# EAGLE design Attiny_Neopixel_Button (EAGLE 8.4.3)
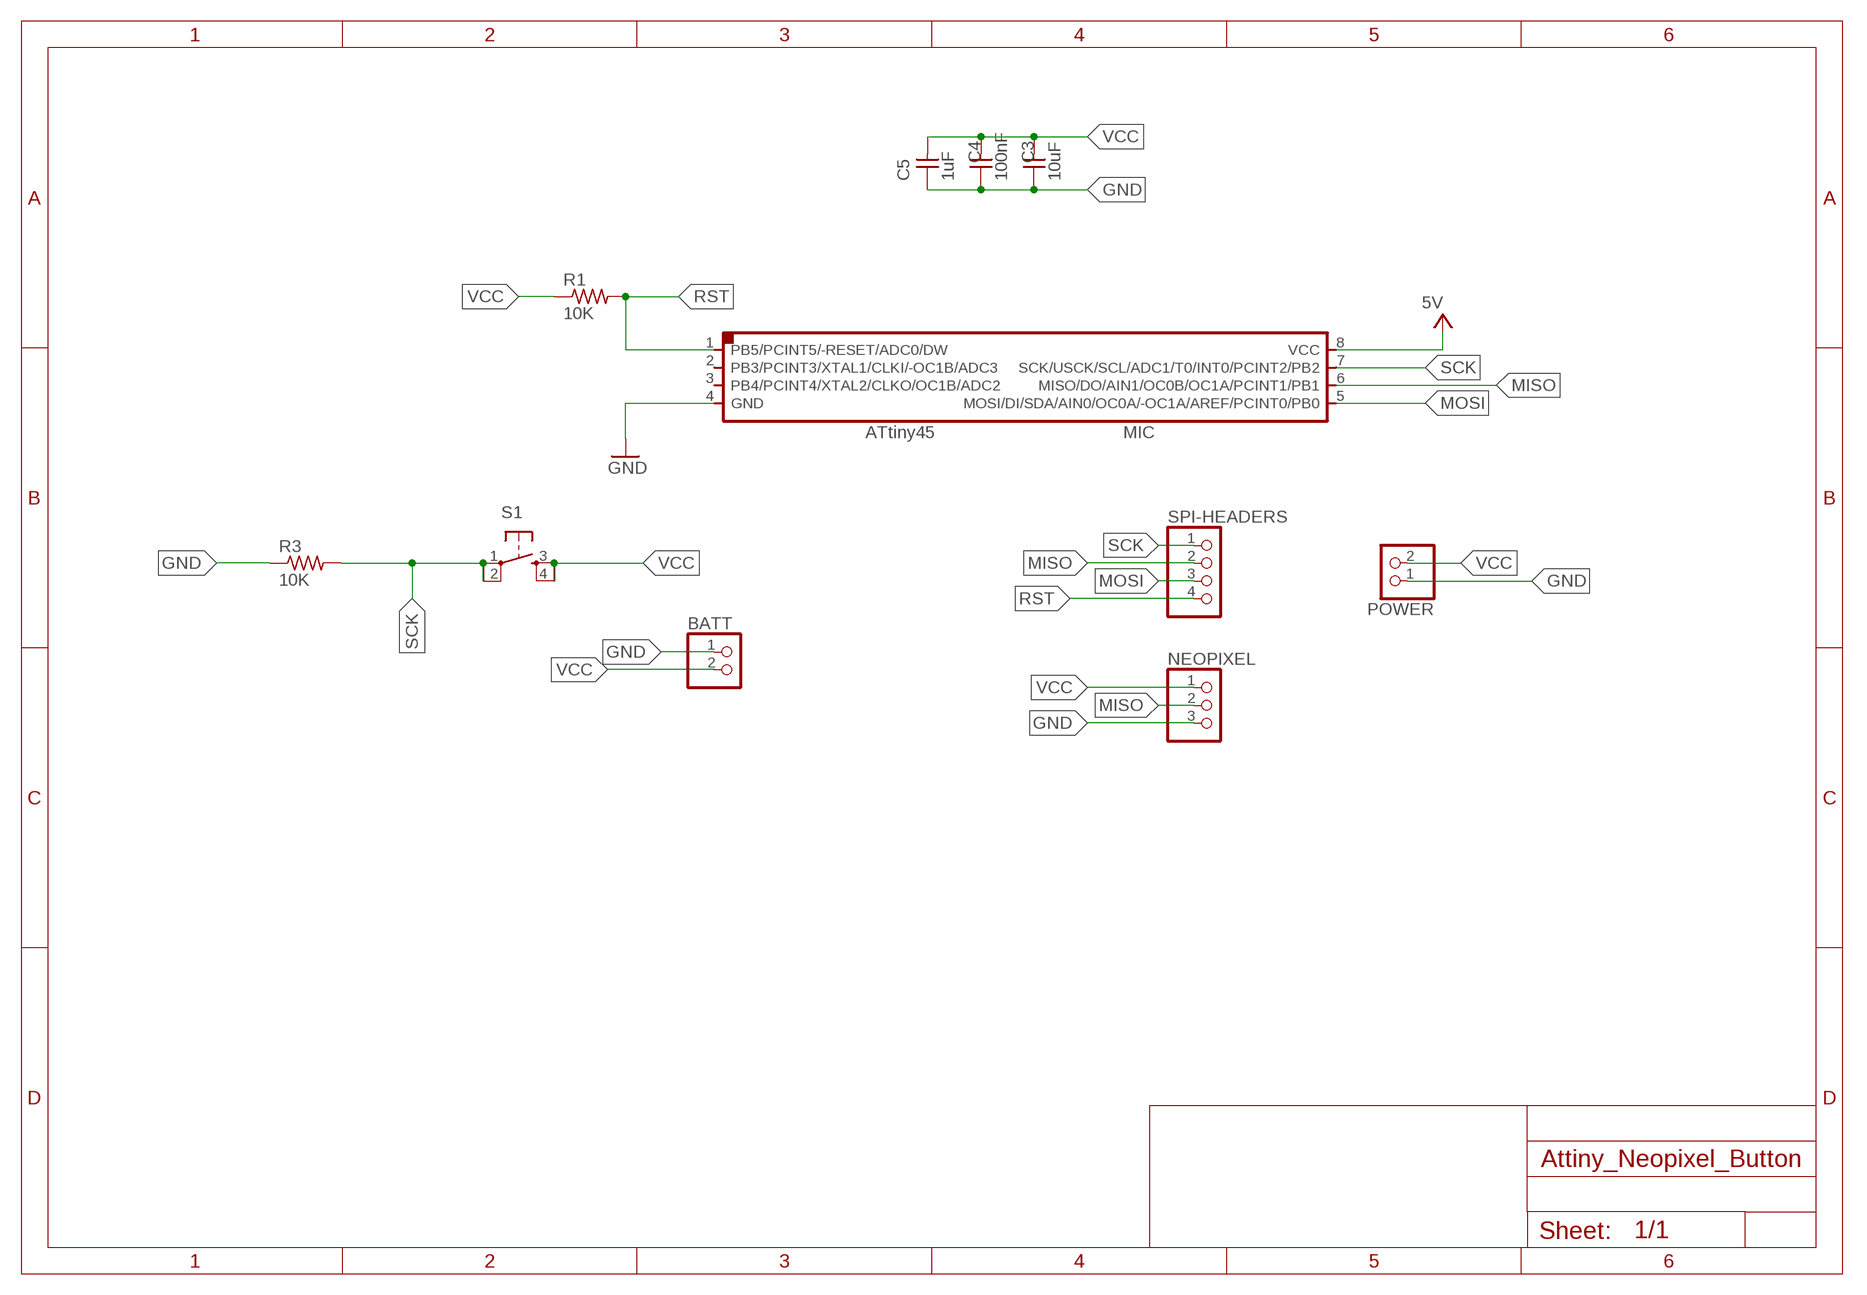
[diagram p0: schematic, sheet 1]

## Parts
BATT  PINHD-1X2  [1X02]
C3  10uF  UNPOLARIZED_CAPACITOR1206  [1206]
C4  100nF  UNPOLARIZED_CAPACITOR1206  [1206]
C5  1uF  UNPOLARIZED_CAPACITOR1206  [1206]
MIC  ATTINY45SI  [SOIC8]
NEOPIXEL  PINHD-1X3  [1X03]
POWER  PINHD-1X2  [1X02]
R1  10K  RESISTOR1206  [1206]
R3  10K  RESISTOR1206  [1206]
S1  6MM_SWITCH6MM_SWITCH  [6MM_SWITCH]
SPI-HEADERS  PINHD-1X4  [1X04]

## Nets
GND: BATT.1 C3.1 C4.1 C5.1 MIC.4(GND) NEOPIXEL.3 POWER.1 R3.1
MISO: MIC.6(MISO/DO/AIN1/OC0B/OC1A/PCINT1/PB1) NEOPIXEL.2 SPI-HEADERS.2
MOSI: MIC.5(MOSI/DI/SDA/AIN0/OC0A/-OC1A/AREF/PCINT0/PB0) SPI-HEADERS.3
RST: MIC.1(PB5/PCINT5/-RESET/ADC0/DW) R1.2 SPI-HEADERS.4
SCK: MIC.7(SCK/USCK/SCL/ADC1/T0/INT0/PCINT2/PB2) R3.2 S1.1(P) S1.2(P1) SPI-HEADERS.1
VCC: BATT.2 C3.2 C4.2 C5.2 MIC.8(VCC) NEOPIXEL.1 POWER.2 R1.1 S1.3(S) S1.4(S1) ; supply symbol labelled 5V
Unconnected: MIC.2(PB3/PCINT3/XTAL1/CLKI/-OC1B/ADC3) MIC.3(PB4/PCINT4/XTAL2/CLKO/OC1B/ADC2)

## Library data of the parts
BATT POWER = pinhead:PINHD-1X2: PIN HEADER
C3-C5 = FAB_Hello:UNPOLARIZED_CAPACITOR: unpolarized_capacitor
MIC = fab:ATTINY45
NEOPIXEL = pinhead:PINHD-1X3: PIN HEADER
R1 R3 = FAB_Hello:RESISTOR
S1 = fab:6MM_SWITCH: OMRON SWITCH
SPI-HEADERS = pinhead:PINHD-1X4: PIN HEADER

## Board
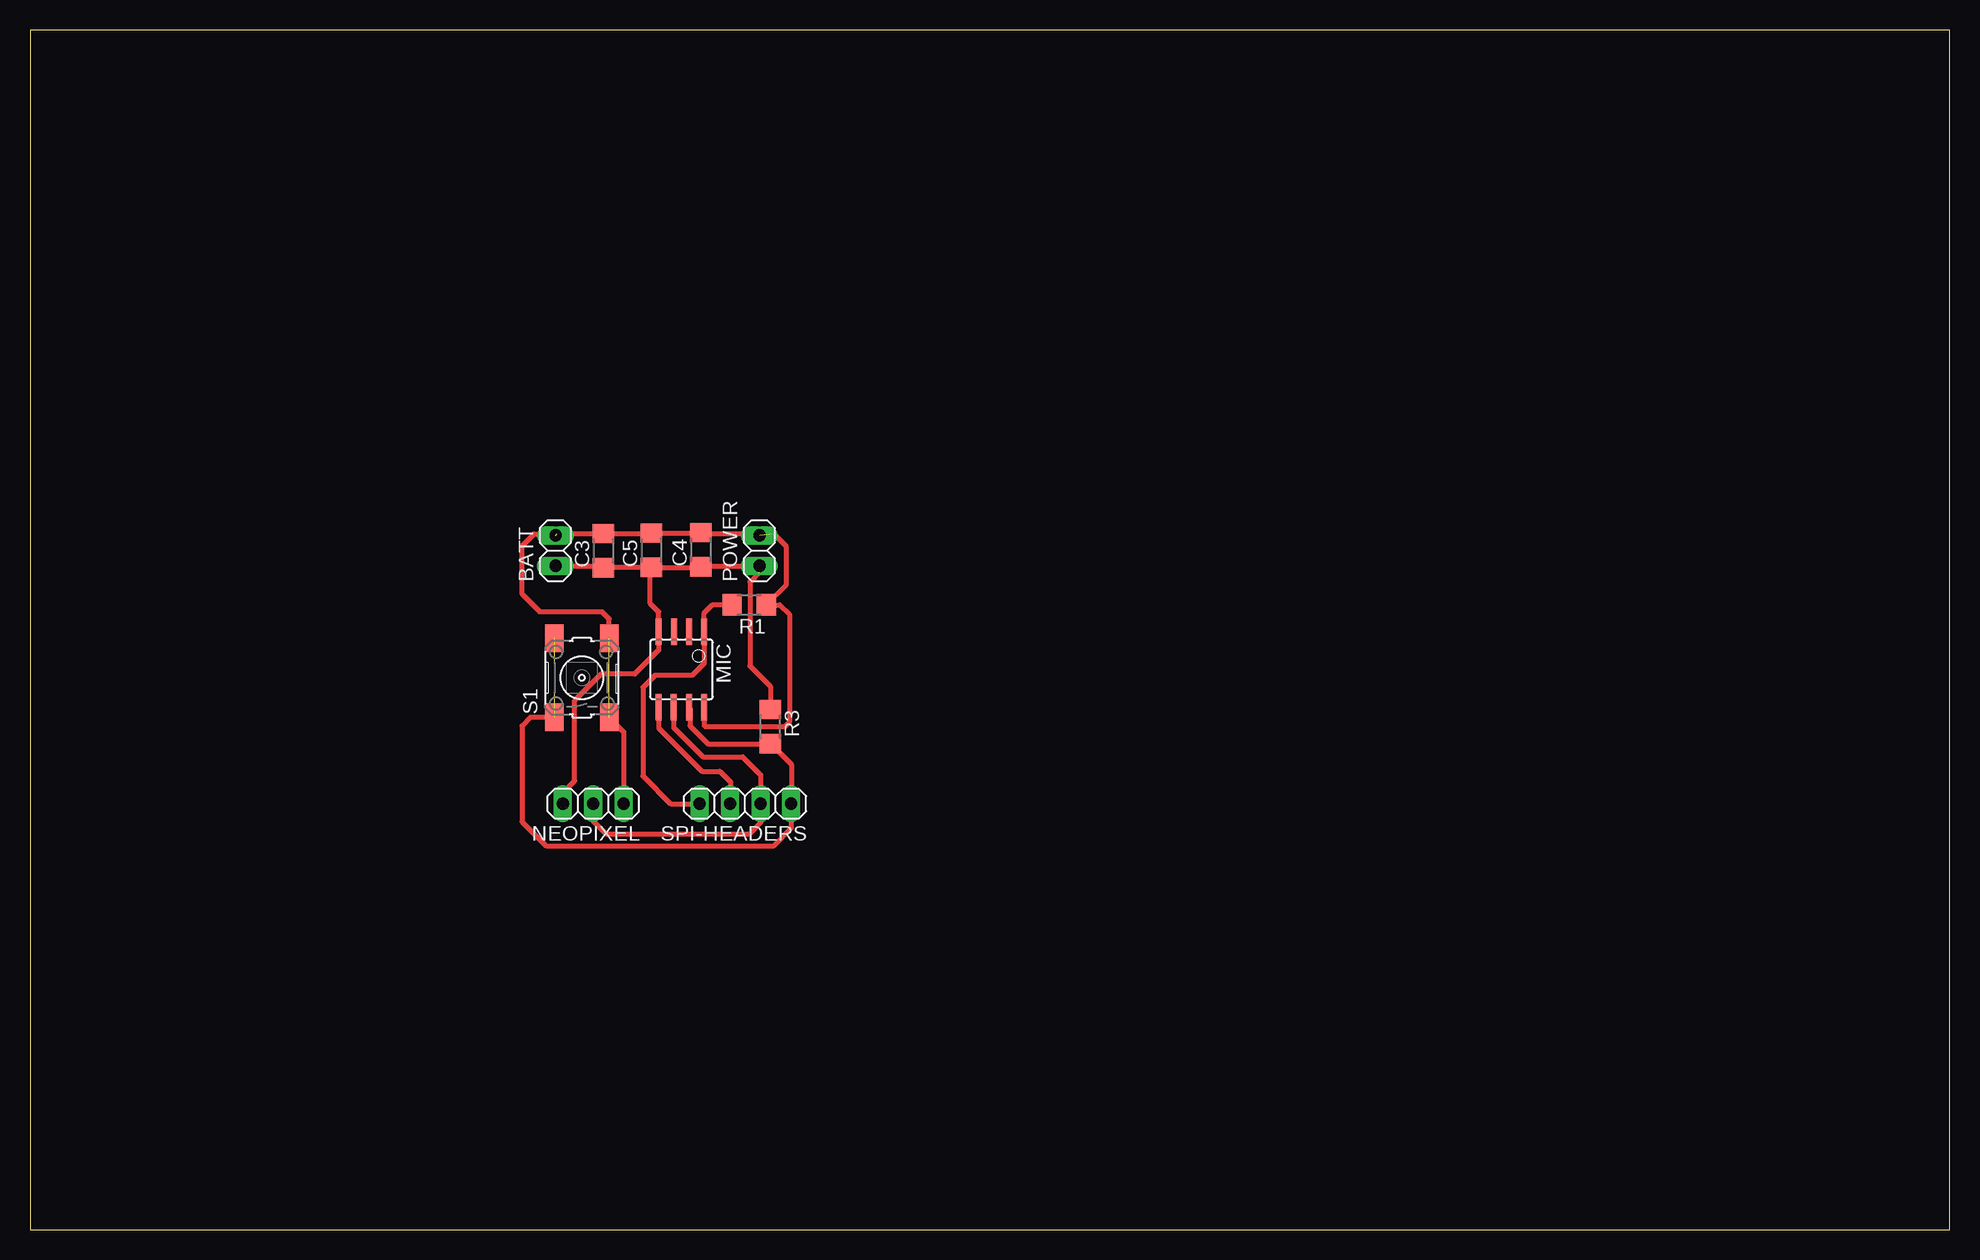
[diagram p1: board, top side]

Size 160 x 100 mm. Coordinates in mm from the lower left corner, seen from the top.
Outline: 0,0 160,0 160,100 0,100 0,0
Copper layers (1*16): Top 0.035mm / dielectric 1.5mm / Bottom 0.035mm
Design rules "default *": minimum track width 6mil, minimum drill 0.35mm, track to track 0.3mm, track to pad 0.3mm, pad to pad 0.3mm, via to via 0.3mm, smd to smd 0.3mm, copper to edge 40mil, drill to drill 6mil, minimum pad ring 10mil, minimum via ring 8mil, stop-mask expansion 4mil, vias tented up to drill 0mil, thermal gap 10mil

### Footprints (pad centres in the part's own frame; a part is rotated, then mirrored left to right if it is on the bottom)
1X02 = drill 1.016 long: 1 -1.27,0; 2 1.27,0
1206 = smd 1.6 x 1.803: 1 -1.422,0; 2 1.422,0
SOIC8 = smd 0.5 x 2.2: 1 -1.905,-3.154; 2 -0.645,-3.154; 3 0.625,-3.154; 4 1.895,-3.154; 5 1.905,3.154; 6 0.635,3.154; 7 -0.635,3.154; 8 -1.905,3.154
1X03 = drill 1.016 long: 1 -2.54,0; 2 0,0; 3 2.54,0
6MM_SWITCH = smd 2.286 x 1.524: 1 -3.302,2.286; 2 3.302,2.286; 3 -3.302,-2.286; 4 3.302,-2.286
1X04 = drill 1.016 long: 1 -3.81,0; 2 -1.27,0; 3 1.27,0; 4 3.81,0

### Placement (x,y rotation side)
BATT  43.8,56.6 90 top
C3  47.78,56.59 90 top
C4  55.91,56.68 90 top
C5  51.78,56.63 90 top
MIC  54.3,46.69 180 top
NEOPIXEL  46.95,35.5 180 top
POWER  60.8,56.6 90 top
R1  59.95,52.08 180 top
R3  61.72,41.93 270 top
S1  46,46 90 top
SPI-HEADERS  59.62,35.5 180 top

### Tracks (layer width: path | path; a pad name or v marks a point on that pad's centre or on a via)
GND  (1 unrouted)
  Top 0.305: 51.7,55.17 51.74,55.17 C5.1 | 55.86,55.21 C4.1 | MIC.4 | 44.41,36.41 NEOPIXEL.3 | C3.1 47.65,55.3 | BATT.1 43.83,55.3
  Top 0.405: C3.1 51.7,55.17 51.7,52.2 52.4,51.5 MIC.4 | C5.1 55.86,55.21 | R3.1 61.72,45.28 60,47 60,54 60.8,54.8 POWER.1 | MIC.4 52.41,48.3 50.4,46.3 47.6,46.3 45.4,44.1 45.4,37.4 44.41,36.41 NEOPIXEL.3 | 43.83,55.3 47.65,55.3 | C4.1 60.73,55.26 60.73,54.73
MISO
  Top 0.152: 53.7,43.5 MIC.6 | SPI-HEADERS.2 60.89,35.4 60.9,35.41
  Top 0.405: MIC.6 53.66,41.84 56.1,39.4 59.4,39.4 60.9,37.9 60.9,35.41 | SPI-HEADERS.2 60.89,33.89 60,33 48,33 46.95,34.05 NEOPIXEL.2
MOSI
  Top 0.152: MIC.5 | 58.4,35.55 SPI-HEADERS.3
  Top 0.405: MIC.5 52.4,41.8 56,38.2 57.5,38.2 58.4,37.3 58.4,35.55
RST
  Top 0.152: MIC.1
  Top 0.305: 58.21,52.1 R1.2
  Top 0.405: 58.21,52.1 56.9,52.1 56.2,51.41 MIC.1 56.2,47.2 55.2,46.2 52.1,46.2 51.1,45.2 51.1,37.8 53.4,35.5 SPI-HEADERS.4
SCK  (1 unrouted)
  Top 0.152: MIC.7 55,43.47 | SPI-HEADERS.1 63.47,35.53 63.5,35.5
  Top 0.305: R3.2
  Top 0.405: 55,43.47 55,42 56.5,40.5 R3.2 | R3.2 63.47,38.76 63.47,35.53 63.47,33.47 62,32 43,32 41,34 41,42 41.7,42.7 S1.1
VCC  (3 unrouted)
  Top 0.305: 51.74,58.01 C5.2 | 55.86,58.05 C4.2 56.01,58 | MIC.8 | 56.3,41.9 56.2,42 | S1.3 48.29,42.69 | 43.93,58 43.94,58.01
  Top 0.405: NEOPIXEL.1 49.49,41.48 48.29,42.69 | 51.74,58.01 C3.2 43.94,58.01 | C5.2 55.86,58.05 | MIC.8 56.2,42 | S1.4 48.29,50.91 47.7,51.5 42.5,51.5 41,53 41,57 42,58 43.93,58 | 56.3,41.9 62.9,41.9 63.3,42.3 63.3,51.3 62.52,52.08 R1.1 63,53.71 63,57 62,58 56.01,58